# EAGLE design Motherboard (EAGLE 6.1)

## Sheet 1 of 3
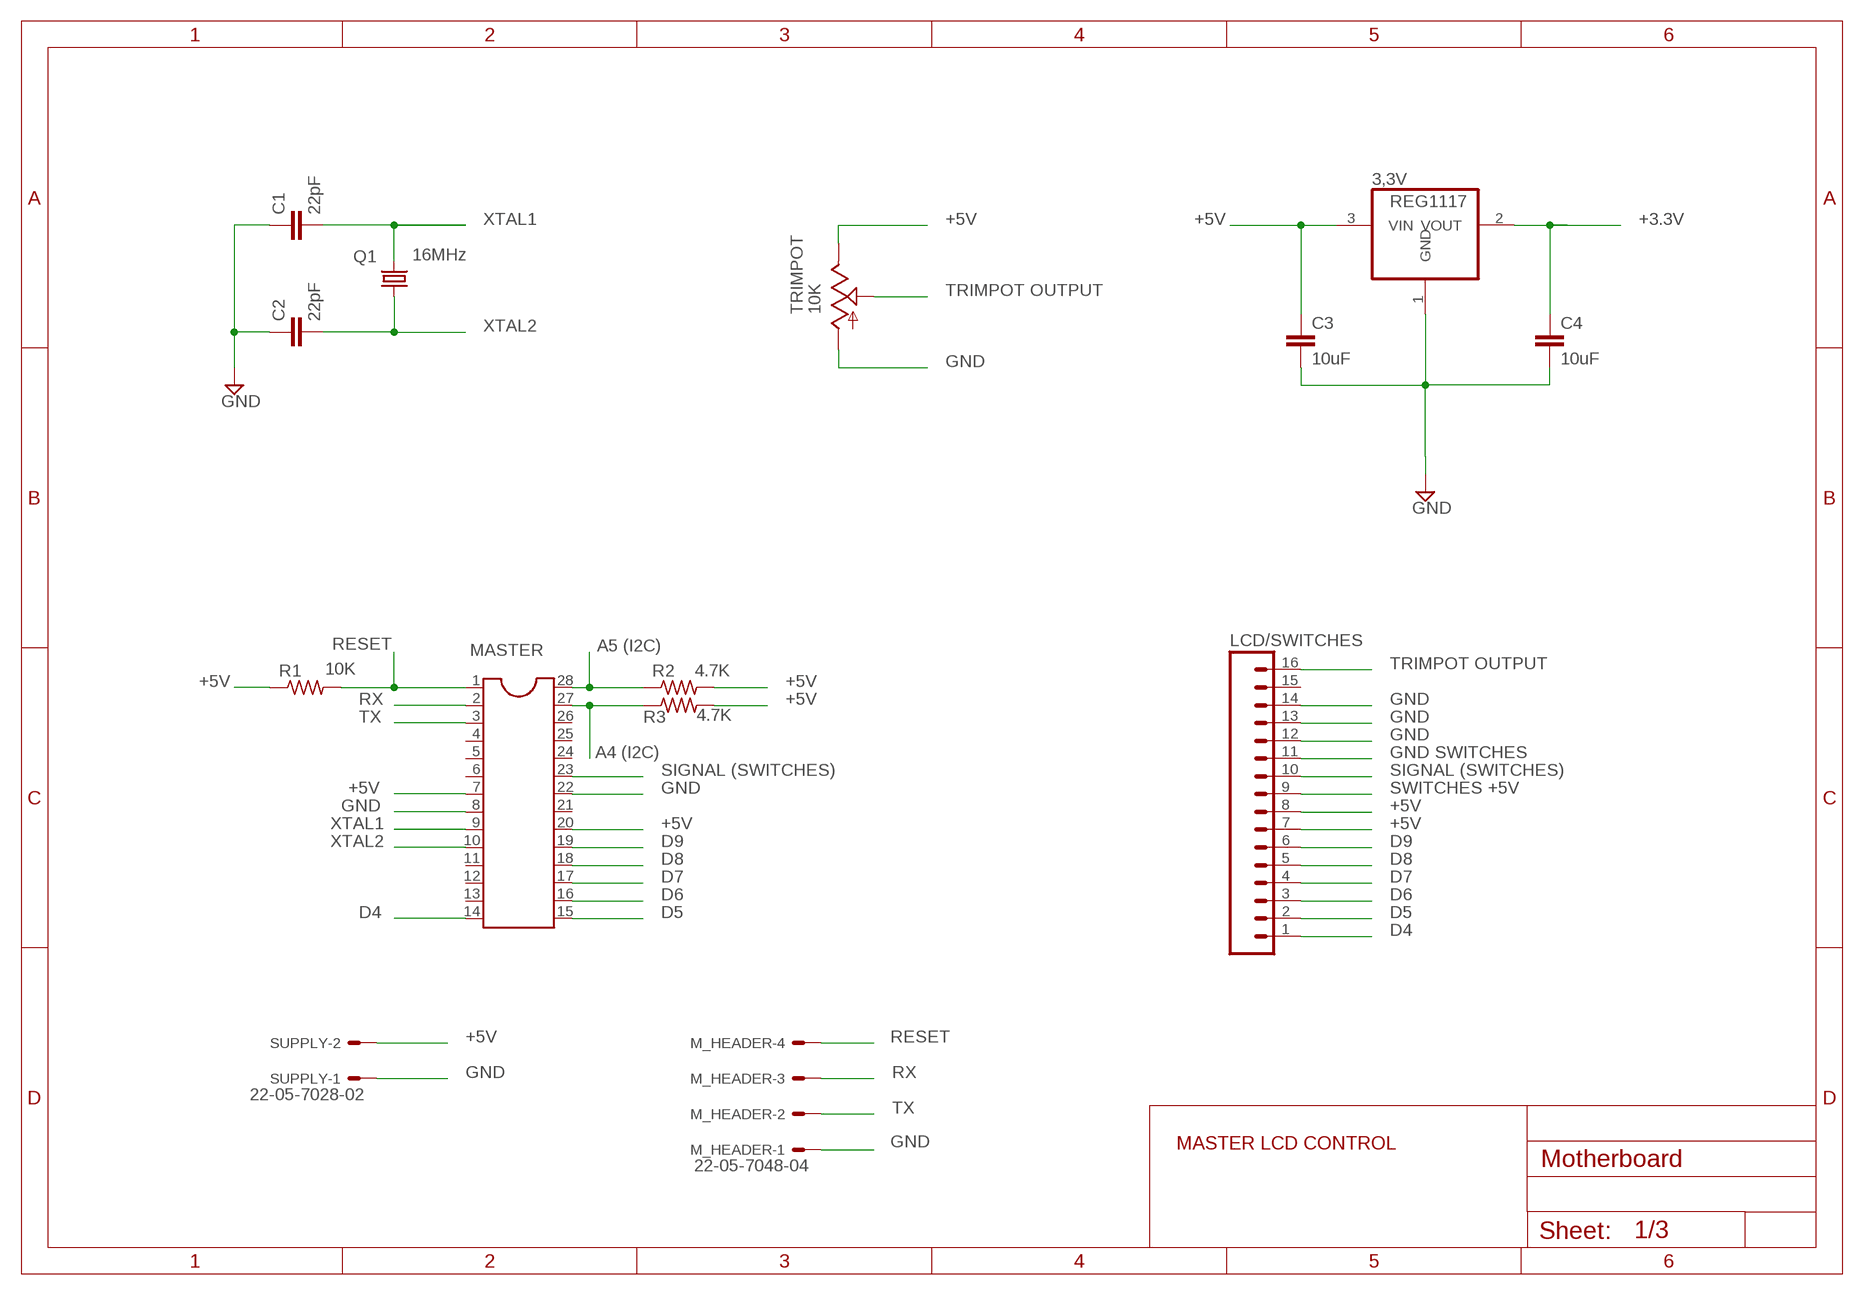
[diagram p0: schematic, sheet 1]

### Parts
3,3V  REG1117  [SOT223]
C1  22pF  C-EUC0805  [C0805]
C2  22pF  C-EUC0805  [C0805]
C3  10uF  C-EUC0805  [C0805]
C4  10uF  C-EUC0805  [C0805]
LCD/SWITCHES  M16  [16P]
M_HEADER  22-05-7048-04  [7395-04]
MASTER  MASTER NODE  DIL28-3  [DIL28-3]
Q1  16MHz  CRYSTALHC49S  [HC49/S]
R1  10K  R-US_M0805  [M0805]
R2  4.7K  R-US_M0805  [M0805]
R3  4.7K  R-US_M0805  [M0805]
SUPPLY  22-05-7028-02  [7395-02]
TRIMPOT  10K  TRIM_US-S64W  [S64W]

### Nets
+3.3V: 3,3V.2(VOUT) C4.1 ; also sheet 3
+5V: 3,3V.3(VIN) C3.1 LCD/SWITCHES.7 LCD/SWITCHES.8 LCD/SWITCHES.9 MASTER.7 MASTER.20 R1.1 R2.2 R3.2 SUPPLY.2 TRIMPOT.E ; also sheet 2,3
A4: MASTER.27 R3.1 ; also sheet 2
A5: MASTER.28 R2.1 ; also sheet 2
D4: LCD/SWITCHES.1 MASTER.14
D5: LCD/SWITCHES.2 MASTER.15
D6: LCD/SWITCHES.3 MASTER.16
D7: LCD/SWITCHES.4 MASTER.17
D8: LCD/SWITCHES.5 MASTER.18
D9: LCD/SWITCHES.6 MASTER.19
GND [Power]: 3,3V.1(GND) C1.1 C2.1 C3.2 C4.2 LCD/SWITCHES.11 LCD/SWITCHES.12 LCD/SWITCHES.13 LCD/SWITCHES.14 M_HEADER.1 MASTER.8 MASTER.22 SUPPLY.1 TRIMPOT.A ; also sheet 2,3
RESET: M_HEADER.4 MASTER.1 R1.2
RX: M_HEADER.3 MASTER.2
SIGNAL: LCD/SWITCHES.10 MASTER.23
TRIMPOT_OUTPUT: LCD/SWITCHES.16 TRIMPOT.S
TX: M_HEADER.2 MASTER.3
XTAL1: C1.2 MASTER.9 Q1.2
XTAL2: C2.2 MASTER.10 Q1.1
Unconnected: LCD/SWITCHES.15 MASTER.4 MASTER.5 MASTER.6 MASTER.11 MASTER.12 MASTER.13 MASTER.21 MASTER.24 MASTER.25 MASTER.26

### Notes on the sheet
- XTAL1 | +5V | +5V | +3.3V
- TRIMPOT OUTPUT
- XTAL2
- GND
- RESET | A5 (I2C)
- TRIMPOT OUTPUT
- +5V | +5V
- RX | +5V | GND
- TX | GND
- GND
- A4 (I2C) | GND SWITCHES
- SIGNAL (SWITCHES) | SIGNAL (SWITCHES)
- +5V | GND | SWITCHES +5V
- GND | +5V
- XTAL1 | +5V | +5V
- XTAL2 | D9 | D9
- D8 | D8
- D7 | D7
- D6 | D6
- D4 | D5 | D5
- D4
- +5V | RESET
- GND | RX
- TX
- GND | MASTER LCD CONTROL

## Sheet 2 of 3
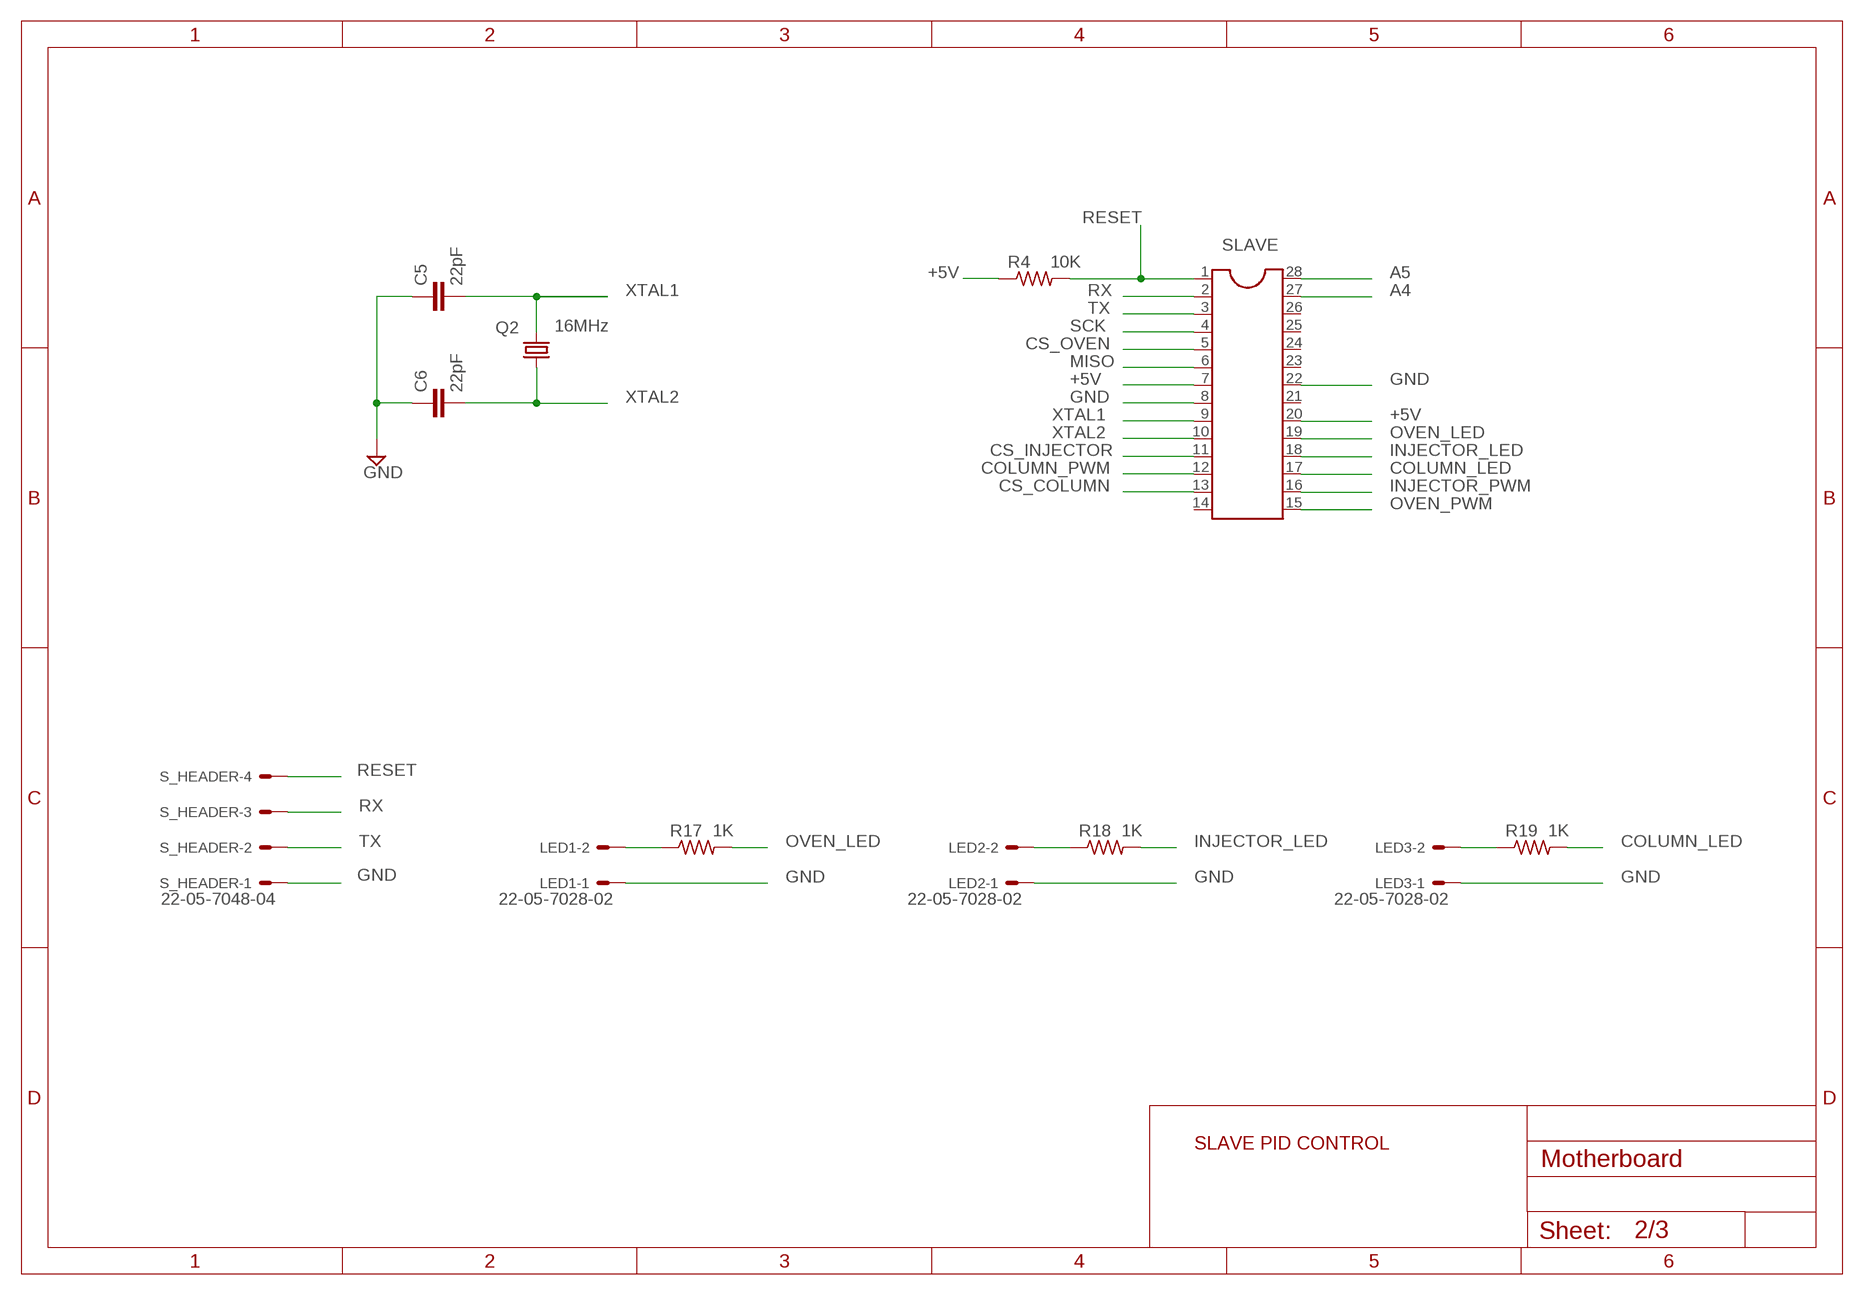
[diagram p1: schematic, sheet 2]

### Parts
C5  22pF  C-EUC0805  [C0805]
C6  22pF  C-EUC0805  [C0805]
LED1  22-05-7028-02  [7395-02]
LED2  22-05-7028-02  [7395-02]
LED3  22-05-7028-02  [7395-02]
Q2  16MHz  CRYSTALHC49S  [HC49/S]
R4  10K  R-US_M0805  [M0805]
R17  1K  R-US_M0805  [M0805]
R18  1K  R-US_M0805  [M0805]
R19  1K  R-US_M0805  [M0805]
S_HEADER  22-05-7048-04  [7395-04]
SLAVE  DIL28-3  [DIL28-3]

### Nets
+5V: R4.1 SLAVE.7 SLAVE.20 ; also sheet 1,3
A4: SLAVE.27 ; also sheet 1
A5: SLAVE.28 ; also sheet 1
COLUMN_LED: R19.2 SLAVE.17
COLUMN_PWM: SLAVE.12 ; also sheet 3
CS_COLUMN: SLAVE.13 ; also sheet 3
CS_INJECTOR: SLAVE.11 ; also sheet 3
CS_OVEN: SLAVE.5 ; also sheet 3
GND [Power]: C5.1 C6.1 LED1.1 LED2.1 LED3.1 S_HEADER.1 SLAVE.8 SLAVE.22 ; also sheet 1,3
INJECTOR_LED: R18.2 SLAVE.18
INJECTOR_PWM: SLAVE.16 ; also sheet 3
MISO: SLAVE.6 ; also sheet 3
N$16: LED2.2 R18.1
N$17: LED3.2 R19.1
N$22: LED1.2 R17.1
OVEN_LED: R17.2 SLAVE.19
OVEN_PWM: SLAVE.15 ; also sheet 3
RESET_SLAVE: R4.2 S_HEADER.4 SLAVE.1
RX_SLAVE: S_HEADER.3 SLAVE.2
SCK: SLAVE.4 ; also sheet 3
TX_SLAVE: S_HEADER.2 SLAVE.3
XTAL1_SLAVE: C5.2 Q2.2 SLAVE.9
XTAL2_SLAVE: C6.2 Q2.1 SLAVE.10
Unconnected: SLAVE.14 SLAVE.21 SLAVE.23 SLAVE.24 SLAVE.25 SLAVE.26

### Notes on the sheet
- RESET
- +5V | A5
- XTAL1 | RX | A4
- TX
- SCK
- CS_OVEN
- MISO
- +5V | GND
- XTAL2 | GND
- XTAL1 | +5V
- XTAL2 | OVEN_LED
- CS_INJECTOR | INJECTOR_LED
- COLUMN_PWM | COLUMN_LED
- CS_COLUMN | INJECTOR_PWM
- OVEN_PWM
- RESET
- RX
- TX | OVEN_LED | INJECTOR_LED | COLUMN_LED
- GND | GND | GND | GND
- SLAVE PID CONTROL

## Sheet 3 of 3
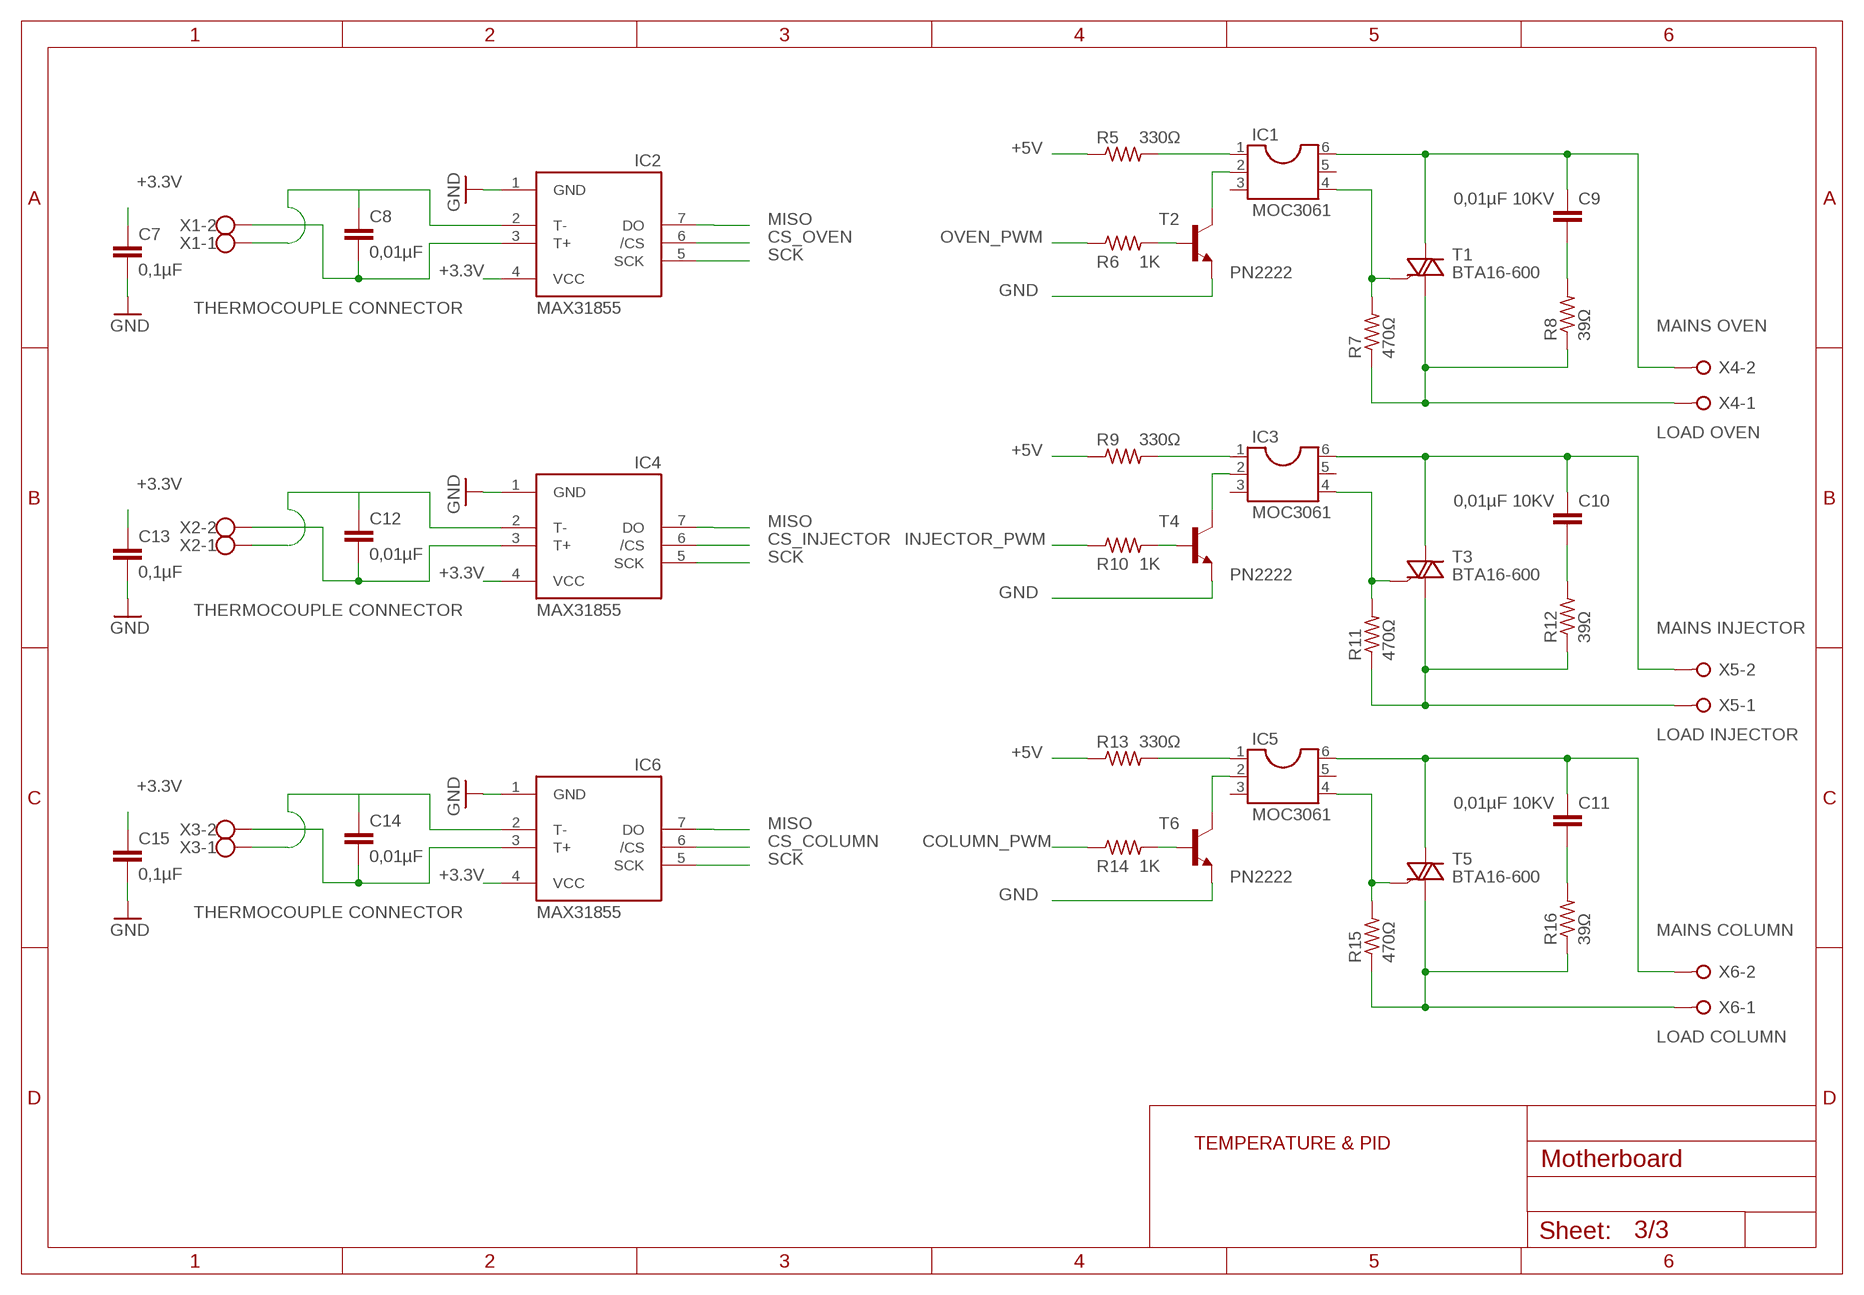
[diagram p2: schematic, sheet 3]

### Parts
C7  0,1µF  C-EUC0805  [C0805]
C8  0,01µF  C-EUC0805  [C0805]
C9  0,01µF 10KV  C-EU050-025X075  [C050-025X075]
C10  0,01µF 10KV  C-EU050-025X075  [C050-025X075]
C11  0,01µF 10KV  C-EU050-025X075  [C050-025X075]
C12  0,01µF  C-EUC0805  [C0805]
C13  0,1µF  C-EUC0805  [C0805]
C14  0,01µF  C-EUC0805  [C0805]
C15  0,1µF  C-EUC0805  [C0805]
IC1  MOC3061  DIL6S  [SOCKET-06]
IC2  MAX31855  MAX6675  [SO08]
IC3  MOC3061  DIL6S  [SOCKET-06]
IC4  MAX31855  MAX6675  [SO08]
IC5  MOC3061  DIL6S  [SOCKET-06]
IC6  MAX31855  MAX6675  [SO08]
R5  330Ω  R-US_M0805  [M0805]
R6  1K  R-US_M0805  [M0805]
R7  470Ω  R-US_0207/10  [0207/10]
R8  39Ω  R-US_0207/10  [0207/10]
R9  330Ω  R-US_M0805  [M0805]
R10  1K  R-US_M0805  [M0805]
R11  470Ω  R-US_0207/10  [0207/10]
R12  39Ω  R-US_0207/10  [0207/10]
R13  330Ω  R-US_M0805  [M0805]
R14  1K  R-US_M0805  [M0805]
R15  470Ω  R-US_0207/10  [0207/10]
R16  39Ω  R-US_0207/10  [0207/10]
T1  BTA16-600  BT138-V  [TO220BV]
T2  PN2222  -NPN-TO92-EBC  [TO92-EBC]
T3  BTA16-600  BT138-V  [TO220BV]
T4  PN2222  -NPN-TO92-EBC  [TO92-EBC]
T5  BTA16-600  BT138-V  [TO220BV]
T6  PN2222  -NPN-TO92-EBC  [TO92-EBC]
X1  W237-102  [W237-102]
X2  W237-102  [W237-102]
X3  W237-102  [W237-102]
X4  W237-02P  [W237-132]
X5  W237-02P  [W237-132]
X6  W237-02P  [W237-132]

### Nets
+3.3V: C7.1 C13.1 C15.1 IC2.4(VCC) IC4.4(VCC) IC6.4(VCC) ; also sheet 1
+5V: R5.1 R9.1 R13.1 ; also sheet 1,2
COLUMN_PWM: R14.1 ; also sheet 2
CS_COLUMN: IC6.6(/CS) ; also sheet 2
CS_INJECTOR: IC4.6(/CS) ; also sheet 2
CS_OVEN: IC2.6(/CS) ; also sheet 2
GND [Power]: C7.2 C13.2 C15.2 IC2.1(GND) IC4.1(GND) IC6.1(GND) T2.E T4.E T6.E ; also sheet 1,2
INJECTOR_PWM: R10.1 ; also sheet 2
LOAD_COLUMN [MAINS]: R15.1 R16.1 T5.T1(A1) X6.1
LOAD_INJECTOR [MAINS]: R11.1 R12.1 T3.T1(A1) X5.1
LOAD_OVEN [MAINS]: R7.1 R8.1 T1.T1(A1) X4.1
MAINS_COLUMN [MAINS]: C11.1 IC5.6 T5.T2(A2) X6.2
MAINS_INJECTOR [MAINS]: C10.1 IC3.6 T3.T2(A2) X5.2
MAINS_OVEN [MAINS]: C9.1 IC1.6 T1.T2(A2) X4.2
MISO: IC2.7(DO) IC4.7(DO) IC6.7(DO) ; also sheet 2
N$1: C10.2 R12.2
N$2: IC3.2 T4.C
N$3: R10.2 T4.B
N$4: C9.2 R8.2
N$5: IC1.2 T2.C
N$6: R6.2 T2.B
N$7: IC1.1 R5.2
N$8: IC3.1 R9.2
N$9: IC1.4 R7.2 T1.G
N$10: IC3.4 R11.2 T3.G
N$11: C11.2 R16.2
N$12: IC5.2 T6.C
N$13: R14.2 T6.B
N$14: IC5.1 R13.2
N$15: IC5.4 R15.2 T5.G
OVEN_PWM: R6.1 ; also sheet 2
SCK: IC2.5(SCK) IC4.5(SCK) IC6.5(SCK) ; also sheet 2
T+: C8.2 IC2.3(T+) X1.2
T+1: C12.2 IC4.3(T+) X2.2
T+2: C14.2 IC6.3(T+) X3.2
T-: C8.1 IC2.2(T-) X1.1
T-1: C12.1 IC4.2(T-) X2.1
T-2: C14.1 IC6.2(T-) X3.1
Unconnected: IC1.3 IC1.5 IC3.3 IC3.5 IC5.3 IC5.5

### Notes on the sheet
- +5V
- +3.3V
- MISO
- CS_OVEN | OVEN_PWM
- SCK
- +3.3V
- GND
- THERMOCOUPLE CONNECTOR
- MAINS OVEN
- LOAD OVEN
- +5V
- +3.3V
- MISO
- CS_INJECTOR | INJECTOR_PWM
- SCK
- +3.3V
- GND
- THERMOCOUPLE CONNECTOR
- MAINS INJECTOR
- LOAD INJECTOR
- +5V
- +3.3V
- MISO
- CS_COLUMN | COLUMN_PWM
- SCK
- +3.3V
- GND
- THERMOCOUPLE CONNECTOR
- MAINS COLUMN
- LOAD COLUMN
- TEMPERATURE & PID

## Library data of the parts
3,3V = burr-brown:REG1117: 800mA and 1A Low Dropout (LDO) Positive Regulator 1.8V, 2.5V, 2.85V, 3.3V, 5V, and Adj; MPN: REG1117; OC_FARNELL: 1097566; OC_NEWARK: 14P6981
C1-C15 = rcl:C-EU: CAPACITOR, European symbol
IC1 IC3 IC5 = ic-package:DIL6: Dual In Line / Socket
IC2 IC4 IC6 = adafruit:MAX6675
LCD/SWITCHES = con-amp-quick:M16: AMP QUICK CONNECTOR; OC_FARNELL: unknown; OC_NEWARK: unknown
LED1-LED3 SUPPLY = con-molex:22-?-02: CONNECTOR wire to board 2.54 mm (.1 inch) pitch header; OC_FARNELL: 9731601; OC_NEWARK: unknown
M_HEADER S_HEADER = con-molex:22-?-04: CONNECTOR wire to board 2.54 mm (.1 inch) pitch header; OC_FARNELL: unknown; OC_NEWARK: unknown
MASTER SLAVE = ic-package:DIL28: Dual In Line
Q1 Q2 = crystal:CRYSTAL: CRYSTAL
R1-R19 = rcl:R-US_: RESISTOR, American symbol
T1 T3 T5 = triac:BT138: TRIAC Source: http://www.semiconductors.philips.com BT138_SERIES_2.pdf
T2 T4 T6 = transistor:*-NPN-: NPN Transistror BF959 corrected 2008.03.06
TRIMPOT = pot:TRIM_US-: POTENTIOMETER
X1-X3 = con-wago-500:W237-102: WAGO SCREW CLAMP; MPN: 237-102; OC_FARNELL: unknown; OC_NEWARK: 70K9898
X4-X6 = con-wago-508:W237-02P: WAGO SREW CLAMP; OC_FARNELL: unknown; OC_NEWARK: unknown

## Net classes
0 default: width 0.8 mm, clearance 0.4 mm
1 Power: width 1.016 mm, drill 0.61 mm, clearance 0.61 mm
2 MAINS: width 1.5 mm, drill 1 mm, clearance 1 mm to class 0

## Board
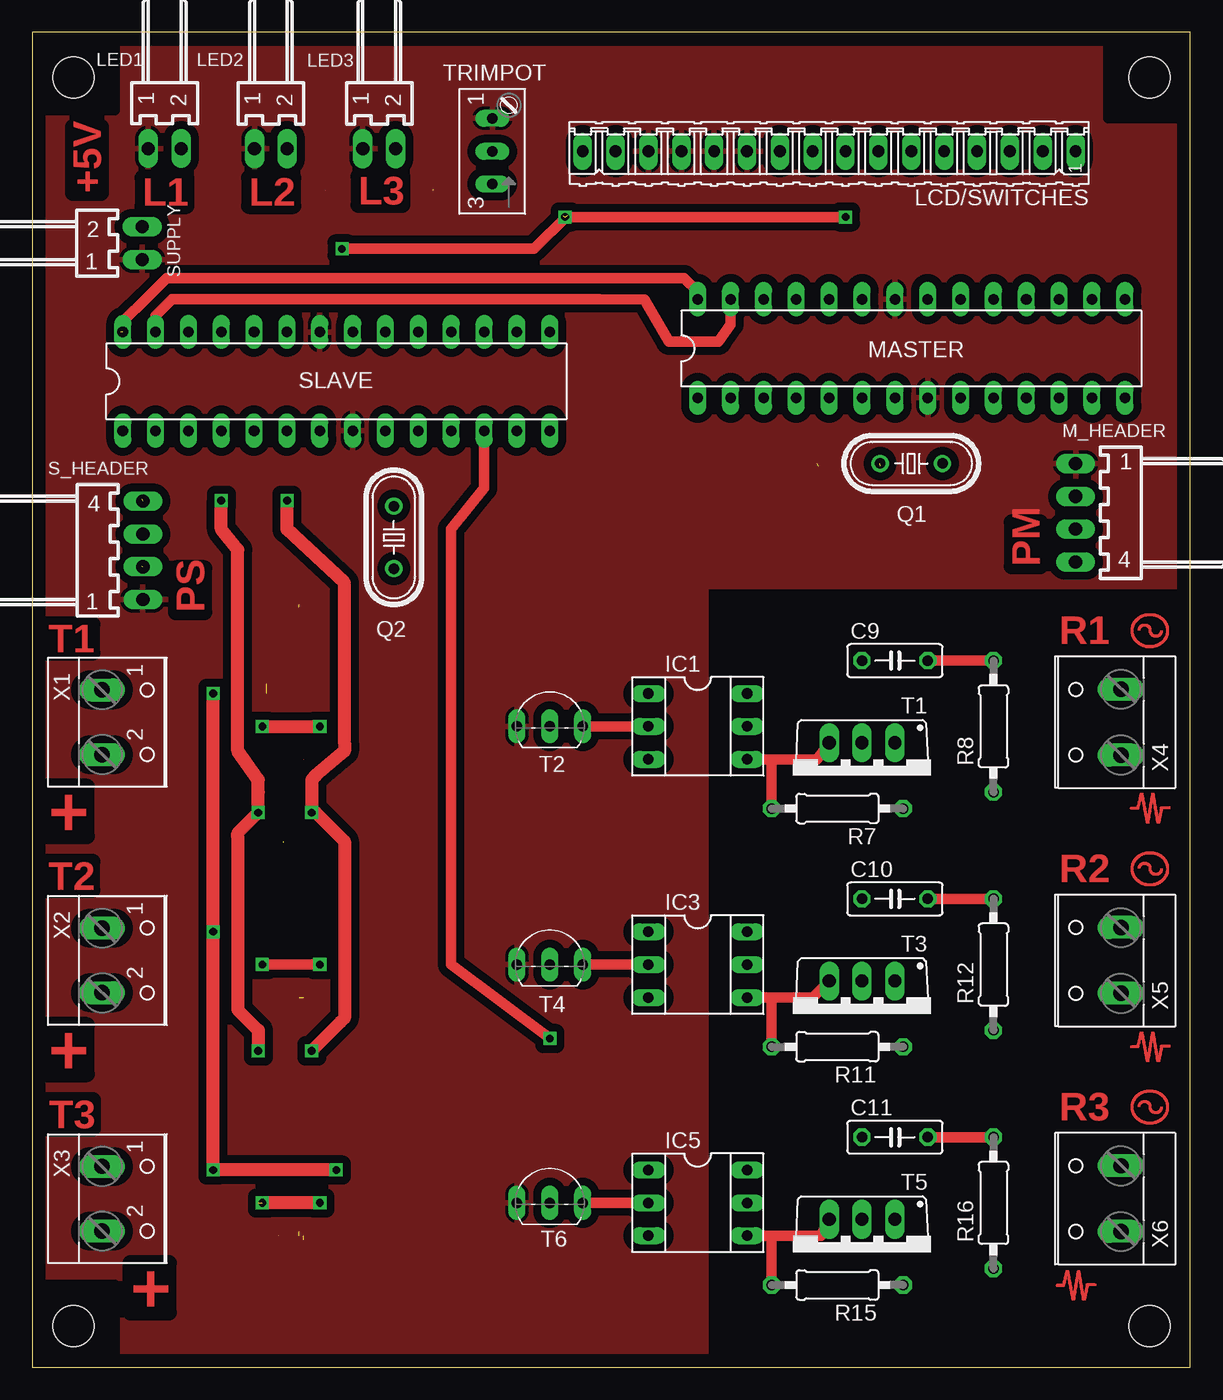
[diagram p3: board, top side]
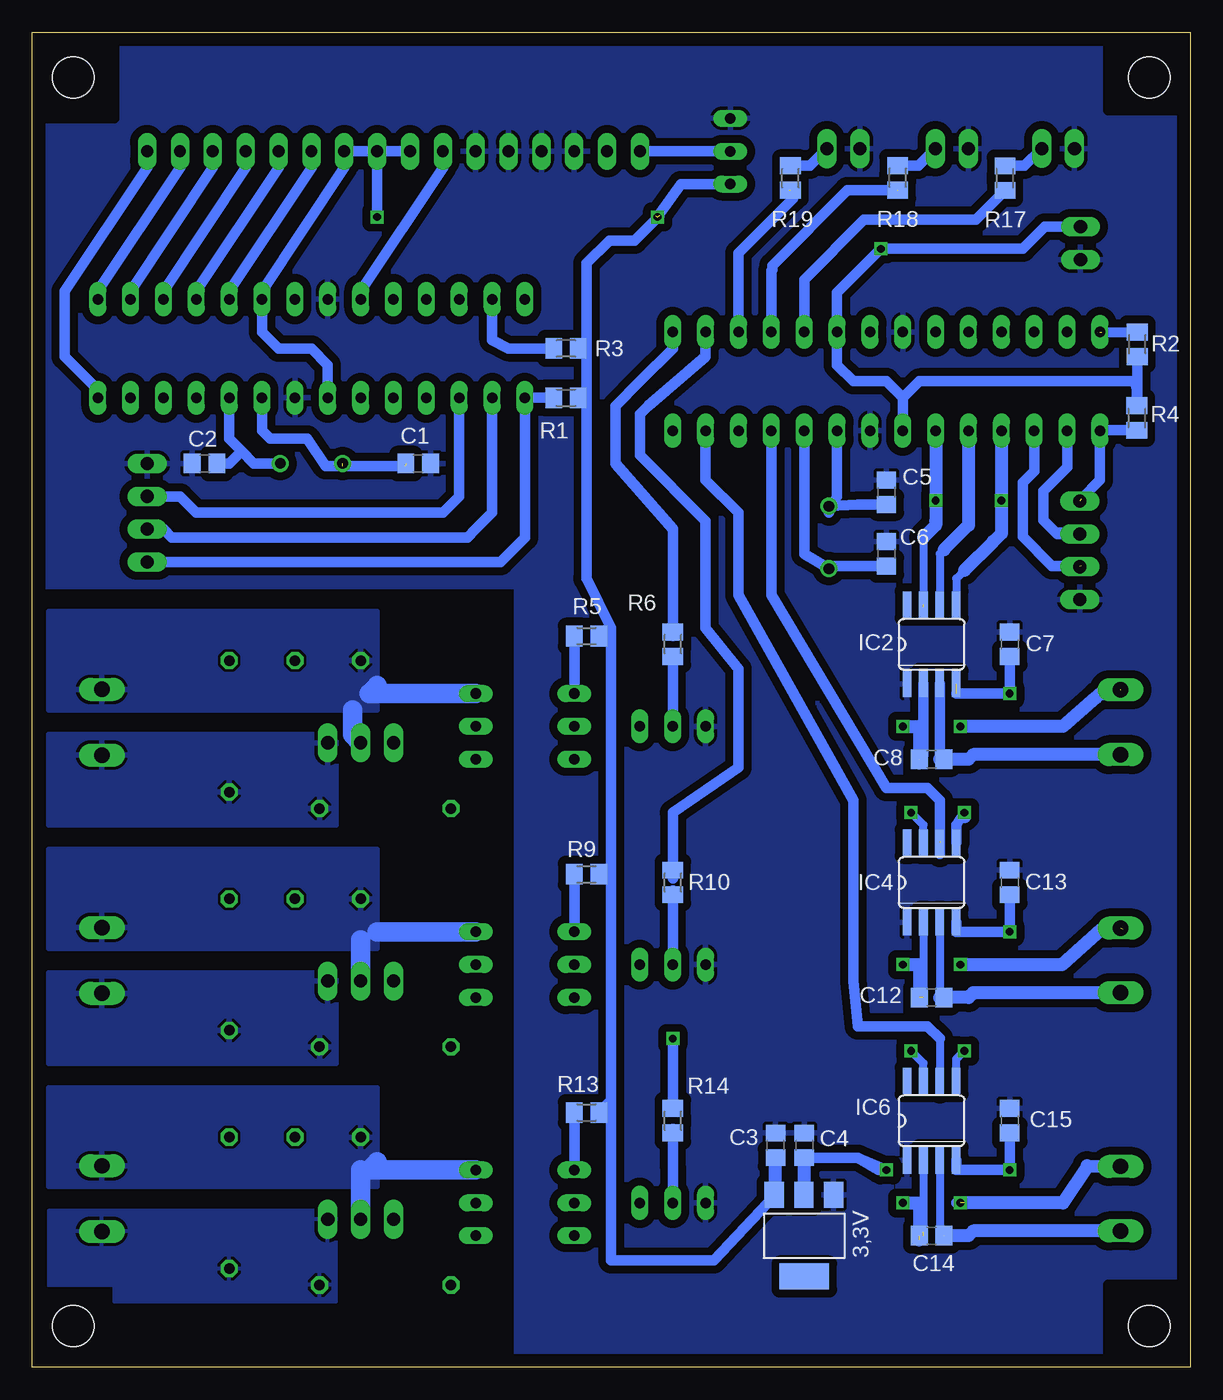
[diagram p4: board, bottom side, seen from below]

Size 89.52 x 103.17 mm. Coordinates in mm from the lower left corner, seen from the top.
Outline: 0,0 89.52,0 89.52,103.17 0,103.17 0,0
Copper layers (1*16): Top 0.035mm / dielectric 1.5mm / Bottom 0.035mm
Design rules: minimum track width 10mil, minimum drill 24mil, track to track 8mil, track to pad 8mil, pad to pad 8mil, via to via 8mil, smd to smd 8mil, copper to edge 40mil, drill to drill 8mil, minimum pad ring 10mil, minimum via ring 8mil, stop-mask expansion 4mil, vias tented up to drill 0mil, thermal gap 10mil
Holes 3.2 mm at 3.17,99.69 3.17,3.17 86.36,3.17 86.36,99.69
tRestrict: area 0,97.2 to 6.3,103.5; area 83.2,96.5 to 89.5,103.5; area 0,0 to 6.3,6.3
bRestrict: area 0,97.2 to 6.3,103.5; area 83.2,96.5 to 89.5,103.5; area 0,0 to 6.3,6.3

### Footprints (pad centres in the part's own frame; a part is rotated, then mirrored left to right if it is on the bottom)
SOT223 = smd 1.499 x 2.007: 1 -2.261,-3.15; 2 0.025,-3.15; 3 2.311,-3.15 | smd 3.81 x 2.007: 4 0,3.15
C0805 = smd 1.3 x 1.5: 1 -0.95,0; 2 0.95,0
C050-025X075 = drill 0.813 octagon: 1 -2.54,0; 2 2.54,0
SOCKET-06 = drill 0.813 long: 1 -2.54,-3.81; 2 0,-3.81; 3 2.54,-3.81; 4 2.54,3.81; 5 0,3.81; 6 -2.54,3.81
SO08 = smd 0.66 x 2.032: 1 -1.905,-3.073; 2 -0.635,-3.073; 3 0.635,-3.073; 4 1.905,-3.073; 5 1.905,3.073; 6 0.635,3.073; 7 -0.635,3.073; 8 -1.905,3.073
16P = drill 0.914 long: 1 -19.05,0; 2 -16.51,0; 3 -13.97,0; 4 -11.43,0; 5 -8.89,0; 6 -6.35,0; 7 -3.81,0; 8 -1.27,0; 9 1.27,0; 10 3.81,0; 11 6.35,0; 12 8.89,0; 13 11.43,0; 14 13.97,0; 15 16.51,0; 16 19.05,0
7395-02 = drill 1.016 long: 1 1.27,0; 2 -1.27,0
7395-04 = drill 1.016 long: 1 3.81,0; 2 1.27,0; 3 -1.27,0; 4 -3.81,0
DIL28-3 = drill 0.813 long: 1 -16.51,-3.81; 2 -13.97,-3.81; 3 -11.43,-3.81; 4 -8.89,-3.81; 5 -6.35,-3.81; 6 -3.81,-3.81; 7 -1.27,-3.81; 8 1.27,-3.81; 9 3.81,-3.81; 10 6.35,-3.81; 11 8.89,-3.81; 12 11.43,-3.81; 13 13.97,-3.81; 14 16.51,-3.81; 15 16.51,3.81; 16 13.97,3.81; 17 11.43,3.81; 18 8.89,3.81; 19 6.35,3.81; 20 3.81,3.81; 21 1.27,3.81; 22 -1.27,3.81; 23 -3.81,3.81; 24 -6.35,3.81; 25 -8.89,3.81; 26 -11.43,3.81; 27 -13.97,3.81; 28 -16.51,3.81
HC49/S = drill 0.813: 1 -2.413,0; 2 2.413,0
M0805 = smd 1.3 x 1.6: 1 -0.95,0; 2 0.95,0
0207/10 = drill 0.813 octagon: 1 -5.08,0; 2 5.08,0
TO220BV = drill 1.016 long: G 2.54,-2.54; T1 -2.54,-2.54; T2 0,-2.54
TO92-EBC = drill 0.813 long: B 0,-1.27; C 2.54,-1.27; E -2.54,-1.27
S64W = drill 0.813 long: A 2.54,1.27; E -2.54,1.27; S 0,1.27
W237-102 = drill 1.194 long: 1 -2.5,-1.27; 2 2.5,-1.27
W237-132 = drill 1.194 long: 1 -2.54,-0.635; 2 2.54,-0.635

### Placement (x,y rotation side)
3,3V  29.84,10.16 180 bottom
C1  59.69,69.85 180 bottom
C2  76.2,69.85 0 bottom
C3  32.07,17.14 90 bottom
C4  29.84,17.14 90 bottom
C5  23.5,67.63 270 bottom
C6  23.5,62.87 270 bottom
C7  13.97,55.88 90 bottom
C8  20,46.99 0 bottom
C9  66.67,54.61 0 top
C10  66.67,36.2 0 top
C11  66.67,17.78 0 top
C12  20,28.57 0 bottom
C13  13.97,37.47 90 bottom
C14  20,10.16 0 bottom
C15  13.97,19.05 90 bottom
IC1  51.44,49.53 270 top
IC2  20,55.88 0 bottom
IC3  51.44,31.11 270 top
IC4  20,37.47 0 bottom
IC5  51.44,12.7 270 top
IC6  20,19.05 0 bottom
LCD/SWITCHES  61.59,93.98 180 top
LED1  10.22,94.19 180 top
LED2  18.44,94.18 180 top
LED3  26.81,94.18 180 top
M_HEADER  80.64,66.04 90 top
MASTER  67.94,78.74 0 top
Q1  67.94,69.85 180 top
Q2  27.94,64.14 90 top
R1  48.26,74.93 180 bottom
R2  4.1,79.06 270 bottom
R3  48.26,78.74 0 bottom
R4  4.14,73.37 270 bottom
R5  46.67,56.52 180 bottom
R6  40.01,55.88 270 bottom
R7  62.23,43.18 180 top
R8  74.3,49.53 90 top
R9  46.67,38.1 180 bottom
R10  40.01,37.47 270 bottom
R11  62.23,24.77 180 top
R12  74.3,31.11 90 top
R13  46.67,19.68 180 bottom
R14  40.01,19.05 270 bottom
R15  62.23,6.35 180 top
R16  74.3,12.7 90 top
R17  14.33,91.9 270 bottom
R18  22.62,91.93 270 bottom
R19  30.92,91.91 270 bottom
S_HEADER  8.55,63.14 270 top
SLAVE  23.5,76.2 0 top
SUPPLY  8.49,86.89 270 top
T1  64.14,45.72 180 top
T2  40.01,50.8 0 top
T3  64.14,27.3 180 top
T4  40.01,32.38 0 top
T5  64.14,8.89 180 top
T6  40.01,13.97 0 top
TRIMPOT  36.83,93.98 90 top
X1  6.66,49.85 270 top
X2  6.66,31.44 270 top
X3  6.66,13.02 270 top
X4  83.51,49.85 90 top
X5  83.51,31.44 90 top
X6  83.51,13.02 90 top

### Tracks (layer width: path | path; a pad name or v marks a point on that pad's centre or on a via)
+3.3V  (via drill 0.6)  (1 unrouted)
  Top 1.016: v23.5,15.24 v13.97,15.24 v13.97,33.66 v13.97,52.07
  Bottom 0.813: v13.97,15.24 16.19,15.24 | IC6.4 18.1,15.24 | 18.1,15.24 16.19,15.24 | 16.19,15.24 v13.97,15.24 | v13.97,15.24 16.19,15.24 | 16.19,15.24 18.1,15.24 | 18.1,15.24 16.19,15.24 | 16.19,15.24 v13.97,15.24 | v13.97,15.24 16.19,15.24 | 16.19,15.24 18.1,15.24 | C4.1 25.72,16.19 | 25.72,16.19 25.71,16.19 v23.5,15.24 24.13,15.24 25.72,16.19 | 28.57,16.19 28.89,16.19 | 28.89,16.19 C4.1 | C4.1 29.87,16.17 | C15.1 v13.97,15.24 | v13.97,33.66 18.1,33.66 | 18.1,33.66 18.1,33.97 | 18.1,33.97 IC4.4 | v13.97,52.07 13.97,53.02 | 13.97,53.02 v13.97,52.07 | v13.97,52.07 18.1,52.07 v13.97,52.07 | C13.1 v13.97,33.66 | v13.97,33.66 18.1,33.66 | 18.1,33.66 18.1,33.97 | 18.1,33.97 18.1,33.66 | C7.1 13.97,53.02 | 25.72,16.19 28.57,16.19 | 28.57,16.19 28.89,16.19 | 28.89,16.19 C4.1 | C4.1 28.89,16.19 | 28.89,16.19 28.57,16.19
  Bottom 1.016: 29.87,16.17 3,3V.2
+5V  (via drill 0.6)  (2 unrouted)
  Top 0.813: v41.18,88.9 v62.87,88.9 | v23.93,86.44 38.77,86.44 41.35,89.02
  Bottom 0.8: 32.07,15.88 C3.1 | 32.07,13.34 3,3V.3 32.07,13.34 | 44.77,38.1 44.77,37.47 44.77,27.62 44.77,20.64 | 44.77,20.64 R13.1 | 44.77,38.1 R9.1 44.77,38.1 | 32.07,13.34 36.83,8.26 44.77,8.26 44.77,8.57 44.77,20.64 | 22.23,74.93 SLAVE.7 22.23,73.03 22.23,74.93 | 4.11,76.31 R4.1 | 22.23,74.93 20.95,76.2 4.11,76.2 | 46.67,74.93 46.67,78.69 R3.2 46.67,78.72 | 46.67,74.93 R1.1 46.67,74.93 | 44.77,56.52 R5.1 | R5.1 | 66.67,76.83 MASTER.7 | 71.75,81.28 MASTER.20 71.75,81.28 | LCD/SWITCHES.8 LCD/SWITCHES.9 | 71.75,80.64 71.75,81.28 | 44.77,38.1 44.77,45.4 44.77,48.58 44.77,56.52 | 44.77,56.52 44.77,57.15 44.77,56.52 | 46.67,74.93 46.67,60.99 46.67,60.96
  Bottom 0.813: 46.67,60.96 46.67,60.99 44.77,57.15 44.77,56.52 | 22.23,74.93 23.5,76.2 26.04,76.2 27.3,77.47 SLAVE.20 27.3,83.07 v23.93,86.44 12.96,86.44 11.25,88.16 SUPPLY.2 | 66.67,76.83 66.67,77.47 67.94,78.74 70.48,78.74 71.75,80.01 MASTER.20 71.75,83.19 65.41,92.71 LCD/SWITCHES.7 LCD/SWITCHES.8 62.87,90.81 v62.87,88.9 | TRIMPOT.E 38.73,91.44 39.37,91.44 40.94,89.22 v41.18,88.9 | 46.67,78.72 46.67,85.32 44.9,87.09 42.96,87.09 41.03,89.02 | R2.2 4.11,75.95 4.25,76.12 4.13,75.68 R4.1 4.11,74.34 4.11,76.2
  Bottom 1.016: 32.07,13.34 32.07,15.88
  other vias: 22.23,72.39
A4
  Top 0.8: 10.79,82.55 10.16,81.92 9.53,81.28 SLAVE.27 | 53.04,79.27 53.98,80.59 MASTER.27
  Top 0.813: 53.04,79.27 49.23,79.27 47.31,82.5 43.81,82.55 10.79,82.55
  Bottom 0.8: R3.1 50.16,78.74 52.7,78.74 53.98,79.38 MASTER.27
A5  (1 unrouted)
  Top 0.813: MASTER.28 51.44,83.13 50.38,84.18 10.38,84.18 8.77,82.57 7.16,80.96 7.16,79.99 6.83,79.99
  Bottom 0.8: R2.1 6.99,79.97 6.99,80.64 SLAVE.28
COLUMN_LED  (1 unrouted)
  Bottom 0.813: SLAVE.17 34.92,86.09 30.71,90.31 30.71,90.64 | 30.71,90.64 31.03,90.96 | 31.03,90.96 30.71,90.64 | 30.71,90.64 31.03,90.64 31.03,90.96 | 31.03,90.96
COLUMN_PWM  (via drill 0.6)
  Top 0.813: SLAVE.12 34.92,67.94 32.38,64.77 32.38,31.11 v40.01,25.4
  Bottom 0.8: 40.01,24.77 v40.01,25.4 40.01,24.77 | 40.01,24.77 R14.1
CS_COLUMN  (via drill 0.6)
  Bottom 0.61: 19.37,22.23 IC6.6 | IC6.6 19.37,21.91 | 19.37,21.91 19.37,21.59 | 19.37,21.59 19.37,21.91 | 19.37,21.91 IC6.6 | IC6.6 19.37,22.23 | 19.37,22.23 IC6.6 | IC6.6 19.37,21.91 | 19.37,21.91 19.37,21.59 | 19.37,25.4 19.37,22.23 | 19.37,22.23 IC6.6 | IC6.6 19.37,21.91 | 19.37,21.91 19.37,21.59 | 19.37,21.59 19.37,21.27 19.37,21.59 | 19.37,21.59 19.37,21.91 | 19.37,21.91 IC6.6 | IC6.6 19.37,22.23 | 19.37,21.59 IC6.6
  Bottom 0.813: 19.37,25.4 20.32,26.35 25.72,26.35 26.04,29.84 26.04,32.7 26.04,43.81 34.92,59.69 34.92,65.72 34.92,66.04 37.47,68.58 SLAVE.13
  other vias: 37.47,72.39 37.47,72.39
CS_INJECTOR  (1 unrouted)
  Bottom 0.61: 19.37,43.5 19.37,43.18 19.37,40.64
  Bottom 0.813: SLAVE.11 32.38,59.69 23.5,44.77 20.32,44.77 19.37,43.81 19.37,43.18 19.37,40.32 | 19.37,40.32 19.37,40.01 | 19.37,40.01 19.37,39.69 19.37,40.01 | 19.37,40.01 19.37,40.32
CS_OVEN
  Bottom 0.61: 19.05,63.18 19.37,62.87 IC2.6
  Bottom 1.016: SLAVE.5 17.14,65.09 19.05,63.18
D4
  Bottom 0.813: MASTER.14 84.45,75.56 87,78.11 87,83.19 80.64,92.71 LCD/SWITCHES.1
D5
  Bottom 0.813: MASTER.15 84.45,83.19 78.11,92.71 LCD/SWITCHES.2
D6
  Bottom 0.813: MASTER.16 81.92,83.19 75.56,92.71 LCD/SWITCHES.3
D7
  Bottom 0.813: MASTER.17 79.38,83.19 73.03,92.71 LCD/SWITCHES.4
D8
  Bottom 0.813: MASTER.18 76.83,83.19 70.48,92.71 LCD/SWITCHES.5
D9
  Bottom 0.813: MASTER.19 74.3,83.19 67.94,92.71 LCD/SWITCHES.6
GND
  pour Bottom: 0.52,0.59 0.64,102.23 88.9,102.23 88.9,60.33 52.07,60.33 52.07,0.64
  pour Top: 0.53,0.59 0.64,102.23 89.14,102.32 88.83,60.33 52.07,60.33 52.07,0.64
INJECTOR_LED  (1 unrouted)
  Bottom 0.813: SLAVE.18 32.38,84.76 32.32,84.83 32.32,85.15 26.51,90.96 22.64,90.96
INJECTOR_PWM
  Bottom 0.8: 34.92,46.35 40.01,42.86 40.01,37.78 R10.1 | 37.47,65.41 42.55,70.48 42.55,73.66
  Bottom 0.813: 34.92,46.35 34.92,52.7 34.92,53.98 37.47,57.15 37.47,65.41 | SLAVE.16 37.47,78.11 41.91,74.3 42.55,73.66 42.55,73.03 42.55,72.39 42.55,70.48
LOAD_COLUMN
  pour Bottom: 66.04,5.08 66.04,12.06 88.27,12.06 88.27,6.35 82.55,6.35 82.55,5.08
  pour Bottom: 66.04,5.08 66.04,12.06 88.27,12.06 88.27,6.35 83.19,6.35 83.19,5.08
  pour Bottom: 66.04,5.08 66.04,12.06 88.27,12.06 88.27,6.35 83.19,6.35 83.19,5.08
  pour Bottom: 66.04,5.08 66.04,12.06 88.27,12.06 88.27,6.99 82.55,6.99 82.55,5.08
LOAD_INJECTOR
  pour Bottom: 88.27,23.5 88.27,30.48 66.04,30.48 66.04,23.5
LOAD_OVEN
  pour Bottom: 66.04,48.9 66.04,41.91 88.27,41.91 88.27,48.9
MAINS_COLUMN
  Bottom 1.5: IC5.6 63.5,15.24 62.87,15.88 | 64.14,13.97 64.14,15.24 64.14,13.97 | 64.14,13.97 T5.T2
  pour Bottom: 88.27,13.97 62.87,13.97 62.87,21.59 88.27,21.59
MAINS_INJECTOR
  Bottom 1.5: IC3.6 55.88,33.66 62.23,33.66 62.87,33.66 | 64.14,33.02 64.14,31.11 T3.T2
  pour Bottom: 88.27,32.38 62.87,32.38 62.87,40.01 88.27,40.01
MAINS_OVEN
  Bottom 1.5: IC1.6 61.59,52.07 63.5,52.07 62.87,52.7 | T1.T2 64.77,48.9 64.77,50.16 64.77,50.8
  pour Bottom: 88.27,50.8 62.87,50.8 62.87,58.42 88.27,58.42
MISO  (via drill 0.6)  (1 unrouted)
  Top 1.016: v19.68,66.99 19.68,64.77 24.13,60.64 24.13,59.69 24.13,48.26 24.13,47.62 21.91,45.72 21.59,45.4 v21.59,42.86 21.91,42.86 24.13,40.64 24.13,26.99 23.81,26.67 v21.59,24.45
  Bottom 0.61: 20.64,64.14 20.64,58.74 | 20.64,41.91 IC4.7 20.64,41.91 | 20.64,41.91 v21.59,42.86 20.64,41.91 | 20.64,23.5 v21.59,24.45 20.64,23.5 | 20.64,22.86 20.64,22.23 IC6.7 20.64,22.86 | 20.64,22.86 20.64,23.5 | 20.64,22.86 20.64,23.5
  Bottom 1.016: SLAVE.6 v19.68,66.99 19.68,65.41 19.68,65.09 20.64,64.14
N$1
  Top 0.8: C10.2 69.85,36.2 72.39,36.2 R12.2
N$2
  Top 0.8: T4.C 43.18,31.11 46.99,31.11 IC3.2
N$3
  Bottom 0.8: R10.2 40.01,36.83 40.01,31.75 T4.B
N$4
  Top 0.813: R8.2 C9.2
N$5
  Top 0.8: T2.C 43.18,49.53 46.99,49.53 IC1.2
N$6
  Bottom 0.8: R6.2 40.01,49.85 T2.B
N$7
  Bottom 0.813: R5.2 IC1.1
N$8
  Bottom 0.813: R9.2 IC3.1
N$9
  Top 0.8: 55.56,46.99 57.15,46.99 | 57.15,46.99 R7.2 | 55.56,46.99 IC1.4 55.56,46.99 | 55.56,46.99 57.15,46.99 | 57.15,46.99 60.64,46.99 T1.G
N$10
  Top 0.8: 57.15,28.57 R11.2 | 57.15,28.57 55.88,28.57 IC3.4 | 57.15,28.57 60.33,28.57 T3.G
N$11
  Top 0.813: R16.2 C11.2
N$12
  Top 0.8: T6.C 43.5,12.7 47.31,12.7 IC5.2
N$13
  Bottom 0.8: R14.2 40.01,18.41 40.01,15.56 T6.B
N$14
  Bottom 0.813: R13.2 IC5.1
N$15
  Top 0.8: 57.15,10.16 57.15,7.62 R15.2 | 57.15,10.16 IC5.4 55.88,10.16 57.15,10.16 | 57.15,10.16 60.96,10.16 T5.G
N$16
  Bottom 0.813: R18.1 21.02,92.88 LED2.2
N$17
  Bottom 0.813: R19.1 29.41,92.86 LED3.2
N$19  (via drill 0.6)
  other vias: 21.59,42.86
N$20  (via drill 0.6)
  other vias: 17.46,42.86
N$21  (via drill 0.6)
  other vias: 21.59,24.45
N$22
  Bottom 0.813: R17.1 12.84,92.85 LED1.2
OVEN_LED
  Bottom 0.813: SLAVE.19 29.84,84.08 25.22,88.7 16.58,88.7 R17.2
OVEN_PWM
  Bottom 0.8: 40.01,60.33 40.01,56.52 R6.1
  Bottom 0.813: SLAVE.15 40.01,78.74 42.55,76.2 44.45,74.3 44.45,69.85 40.01,64.77 40.01,60.33
RESET  (via drill 0.6)
  Bottom 0.8: v51.44,74.93 50.16,74.93 R1.2
  Bottom 0.813: v51.44,74.93 51.44,64.14 53.34,62.23 M_HEADER.4
RESET_SLAVE  (1 unrouted)
  Bottom 0.8: R4.2 6.99,72.44 6.99,71.75 SLAVE.1
  Bottom 0.813: 6.99,71.75 6.99,68.55 8.45,67.09 | 8.45,67.09 8.45,66.76 8.45,67.09
RX
  Bottom 0.813: MASTER.2 53.98,66.04 55.24,64.77 55.88,64.14 78.11,64.14 78.74,64.14 79.38,64.77 M_HEADER.3
RX_SLAVE
  Bottom 0.8: 9.53,70.48 SLAVE.2
  Bottom 0.813: 9.53,70.48 9.53,69.56 11.35,67.73 11.35,65.47 10.38,64.51 | 10.38,64.51 9.74,64.51 | 9.74,64.51 9.42,64.51 | 9.42,64.51 9.09,64.51 | 9.09,64.51 8.77,64.51 | 8.77,64.51 8.45,64.51 | 8.45,64.51 8.77,64.51 | 8.77,64.51 9.09,64.51 | 9.09,64.51 9.42,64.51 | 9.42,64.51 9.09,64.51 | 9.09,64.51 8.77,64.51 | 8.77,64.51 8.45,64.51 | 8.45,64.51 8.12,64.18 9.42,64.18 9.74,64.51 | 9.74,64.51 9.42,64.51 | 9.42,64.51 9.09,64.51 | 9.09,64.51 8.77,64.51 | 8.77,64.51 8.45,64.51 | 8.45,64.51 7.8,64.51 8.45,64.51 | 8.45,64.51 9.09,64.51 | 9.09,64.51 9.42,64.51 | 9.42,64.51 9.09,64.51 | 9.09,64.51 8.45,64.51 | S_HEADER.3 10.28,64.41 10.38,64.51
SCK  (via drill 0.6)
  Top 1.016: v14.61,66.99 14.61,64.77 15.88,63.18 15.88,47.62 17.46,45.4 17.46,44.45 v17.46,42.86 15.88,41.27 15.88,40.96 15.88,27.62 17.46,26.04 v17.46,24.45
  Bottom 0.61: 17.46,61.59 18.1,60.96 IC2.5 | IC6.5 18.1,22.54 18.1,23.81 v17.46,24.45 | 18.1,40.64 18.1,40.32 18.1,40.64
  Bottom 0.813: IC4.5 18.1,40.64 18.1,41.91 v17.46,42.86
  Bottom 1.016: SLAVE.4 v14.61,66.99 14.61,64.45 15.24,63.82 17.46,61.59 | v17.46,42.86 17.46,42.55 | 17.46,42.55 v17.46,42.86 | v17.46,42.86 17.46,42.55 | 17.46,42.55 v17.46,42.86
SIGNAL
  Bottom 0.813: MASTER.23 64.14,83.19 57.78,92.71 LCD/SWITCHES.10
T+
  Bottom 0.813: 19.37,46.99 C8.2 19.37,47.3 IC2.3
  Bottom 1.016: X1.2 16.78,47.35 17.14,46.99 C8.2 19.37,46.99
T+1
  Bottom 0.61: IC4.3 19.37,28.57
  Bottom 0.8: 19.37,28.57 C12.2
  Bottom 1.016: C12.2 19.37,28.57 17.14,28.57 16.78,28.94 X2.2
T+2  (1 unrouted)
  Bottom 0.406: 19.37,10.47 C14.2
  Bottom 0.61: IC6.3 19.37,10.47
  Bottom 1.016: X3.2 16.78,10.52 17.14,10.16 C14.2
T-  (via drill 0.6)  (2 unrouted)
  Top 1.016: v17.78,49.53 v22.23,49.53
  Bottom 0.8: 17.14,49.53 v17.78,49.53
  Bottom 0.813: IC2.2 20.64,47.3 C8.1
  Bottom 1.016: v17.78,49.53 9.84,49.53 7.3,51.75 6.99,52.07 5.71,52.07 5.4,52.39 | v22.23,49.53 20.95,49.53 C8.1 | C8.1 20.95,46.67 | 20.95,46.67 C8.1 | C8.1 20.95,46.67 | 20.95,46.67 C8.1
T-1  (via drill 0.6)  (3 unrouted)
  Top 0.813: v17.78,31.11 v22.23,31.11
  Bottom 0.61: IC4.2 20.64,28.57
  Bottom 1.016: v17.78,31.11 9.9,31.11 6.83,33.86 | 6.83,33.86 | 6.83,33.86 6.51,33.86 | 6.51,33.86 5.22,33.86 6.51,33.86 | 6.51,33.86 5.87,33.86 6.51,33.86 | v22.23,31.11 20.95,31.11 20.95,28.89 C12.1
T-2  (via drill 0.6)  (3 unrouted)
  Top 1.016: v22.23,12.7 v17.78,12.7
  Bottom 0.406: 20.64,10.47 C14.1 | 20.64,9.84 20.64,10.16
  Bottom 0.61: IC6.2 20.64,12.06 20.64,10.47
  Bottom 0.813: 7.98,15.57 7.98,15.53 | 17.46,12.7 18.1,12.7
  Bottom 1.016: 7.98,15.57 X3.1 | 7.98,15.53 9.84,12.7 17.46,12.7 | v22.23,12.7 20.95,12.7 20.95,9.84
TRIMPOT_OUTPUT
  Bottom 0.813: TRIMPOT.S 36.83,93.98 38.1,93.98 LCD/SWITCHES.16
TX
  Bottom 0.813: MASTER.3 56.52,67.31 57.78,66.04 76.83,66.04 78.11,67.31 M_HEADER.2
TX_SLAVE  (1 unrouted)
  Bottom 0.8: 12.06,71.12 SLAVE.3
  Bottom 0.813: 12.06,71.12 12.06,69.28 12.96,68.38 12.96,64.83 12.96,64.18 10.71,61.92 9.42,61.92 | 9.42,61.92 9.09,61.92 | 9.09,61.92 8.77,61.92 | 8.77,61.92 8.45,61.92 | 8.45,61.92 8.77,61.92 | 8.77,61.92 9.09,61.92 | 9.09,61.92 9.42,61.92 | 9.42,61.92 8.45,61.92
XTAL1  (2 unrouted)
  Bottom 0.813: MASTER.9 71.75,72.39 71.12,71.75 68.61,71.75 68.28,71.75 66.83,69.67 65.55,69.67 60.71,69.67
XTAL1_SLAVE
  Bottom 0.8: 27.3,67.31 27.94,66.04 Q2.2
  Bottom 0.813: 27.3,67.31 SLAVE.9 | C5.2 25.72,66.67 Q2.2
XTAL2
  Bottom 0.8: 72.39,69.85 73.34,70.8 74.3,71.75 MASTER.10
  Bottom 0.813: Q1.1 72.39,69.85 | C2.2 74.3,69.85 73.34,70.8
XTAL2_SLAVE
  Bottom 0.813: SLAVE.10 29.84,62.87 Q2.1 27.62,61.91 C6.2
(copper drawn outside any net)
  shapes: Top area x1671

### Text on the board
Top: +5V | L1 | L2 | L3 | PM | PS | R1 | T1 | + | T2 | R2 | + | R3 | T3 | +